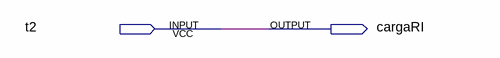
[diagram p0: schematic sheet]
// Quartus schematic carga_ri.bdf as structural Verilog: 0 symbols, 2 pins
module carga_ri (
  input  t2,
  output cargaRI
);


  assign cargaRI = t2;
endmodule
